# EAGLE schematic miernik-temperatury (EAGLE 8.1.1)
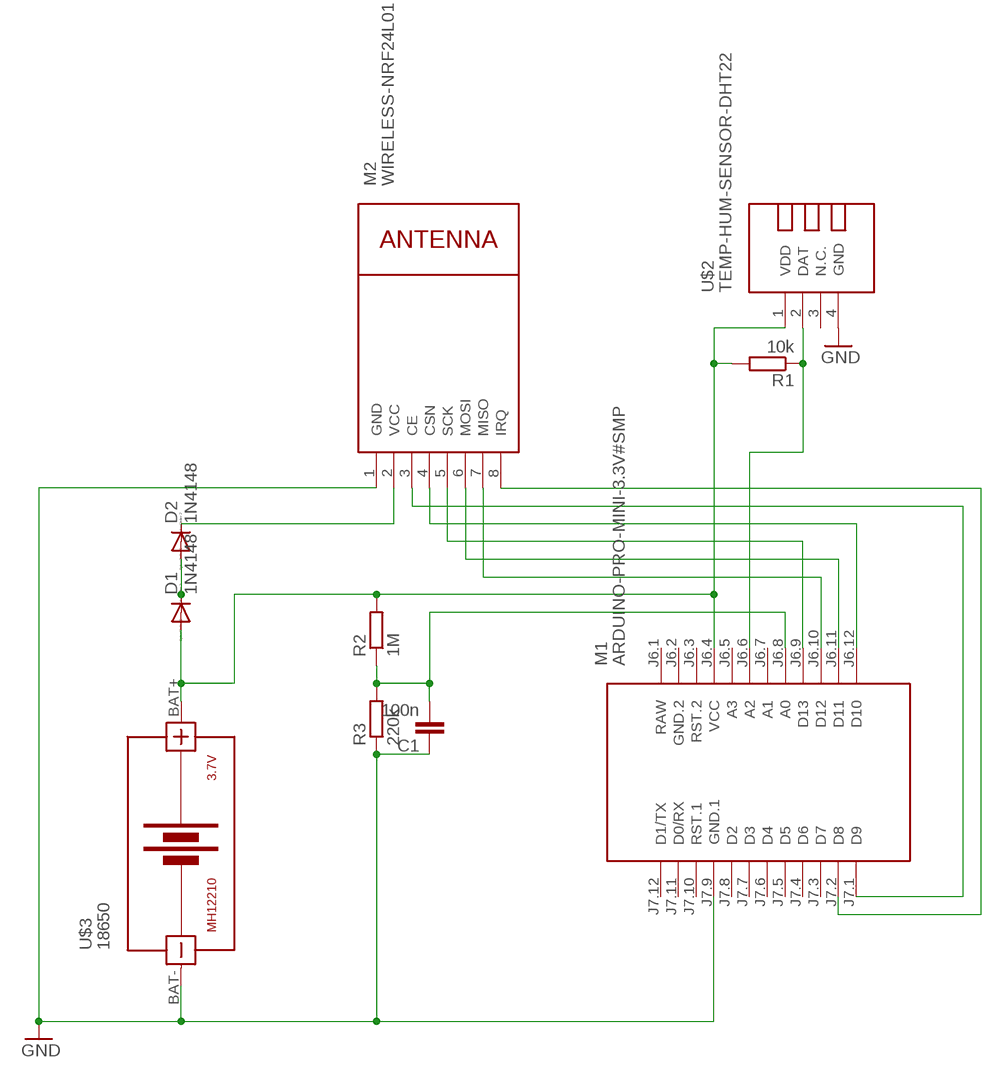
[diagram p0: schematic, sheet 1]

## Parts
C1  100n  C5/3  [C5B3]
D1  1N4148  1N4148DO35-10  [DO35-10]
D2  1N4148  1N4148DO35-10  [DO35-10]
M1  ARDUINO-PRO-MINI-3.3V#SMP  [ARDUINO-PRO-MINI#SMP]
M2  WIRELESS-NRF24L01  [WIRELESS-NRF24L01]
R1  10k  R-EU_0309/12  [0309/12]
R2  1M  R-EU_0309/12  [0309/12]
R3  220k  R-EU_0309/12  [0309/12]
U$2  TEMP-HUM-SENSOR-DHT22  [TEMP-HUM-SENSOR-DHT22]
U$3  18650  BATTERY-LI-MH12210  [BATTERY-LI-MH12210]

## Nets
GND: C1.1 M1.J7.9(GND.1) M2.1(GND) R3.1 U$2.4(GND) U$3.BAT-
N$2: D2.C M2.2(VCC)
N$4: M1.J7.1(D9) M2.3(CE)
N$5: M1.J6.12(D10) M2.4(CSN)
N$6: M1.J6.9(D13) M2.5(SCK)
N$7: M1.J6.11(D11) M2.6(MOSI)
N$8: M1.J6.10(D12) M2.7(MISO)
N$10: M1.J7.2(D8) M2.8(IRQ)
N$11: D1.A M1.J6.4(VCC) R1.2 R2.2 U$2.1(VDD) U$3.BAT+
N$12: M1.J6.6(A2) R1.1 U$2.2(DAT)
N$13: C1.2 M1.J6.8(A0) R2.1 R3.2
N$17: D1.C D2.A
Unconnected: M1.J6.3(RST.2) M1.J6.5(A3) M1.J6.7(A1) M1.J7.3(D7) M1.J7.4(D6) M1.J7.5(D5) M1.J7.6(D4) M1.J7.7(D3) M1.J7.8(D2) M1.J7.10(RST.1) M1.J7.11(D0/RX) M1.J7.12(D1/TX) U$2.3(N.C.)

## Power pins joined to a net without a drawn wire
GND.2: M1.J6.2(GND.2)
RAW: M1.J6.1(RAW)

## Library data of the parts
C1 = capacitor-wima:C: CAPACITOR naming: grid - package width
D1 D2 = diode:1N4148: DIODE high speed (Philips)
M1 = diy-modules:ARDUINO-PRO-MINI-*#SMP: Arduino Pro Mini (and compatible devices) with 2 connectors only More details available here: https://www.arduino.cc/en/Main/ArduinoBoardProMini Click here to find device on ebay.com <http://www.ebay.com/sch/arduino+pro+mini>
M2 = diy-modules:WIRELESS-NRF24L01: 2.4 GHz Wireless Module based on NRF24L01 chip More details available here: http://www.electrodragon.com/w/NRF24L01 Click here to find device on ebay.com <http://www.ebay.com/sch/nrf24l01+arduino>
R1-R3 = rcl:R-EU_: RESISTOR, European symbol
U$2 = diy-modules:TEMP-HUM-SENSOR-DHT22: DHT22 - digital humidity & temperature sensor Also known as: AM2302 AM2302 datasheet available here: http://akizukidenshi.com/download/ds/aosong/AM2302.pdf Click here to find device on ebay.com <http://www.ebay.com/sch/dht22+digital+sensor>
U$3 = diy-modules:BATTERY-LI-MH12210: Lithium-Ion MH12210 Rechargeable Battery Panasonic NCR18650PF battery datasheet available here: https://industrial.panasonic.com/cdbs/www-data/pdf2/ACI4000/ACI4000C12.pdf Click here to find device on ebay.com <http://www.ebay.com/sch/ncr18650b+battery>